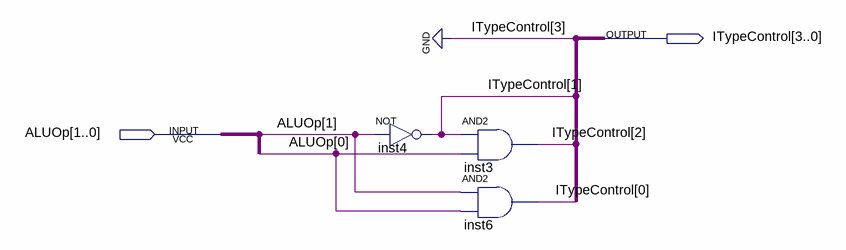
[diagram p0: schematic sheet]
// Quartus schematic ITypeControl.bdf as structural Verilog: 3 symbols, 2 pins
module ITypeControl (
  input  [1:0] ALUOp,
  output [3:0] ITypeControl
);

  not inst4 (ITypeControl[1], ALUOp[1]);
  and inst3 (ITypeControl[2], ITypeControl[1], ALUOp[0]);
  and inst6 (ITypeControl[0], ALUOp[1], ALUOp[0]);

  assign ITypeControl[3] = 1'b0;
endmodule
